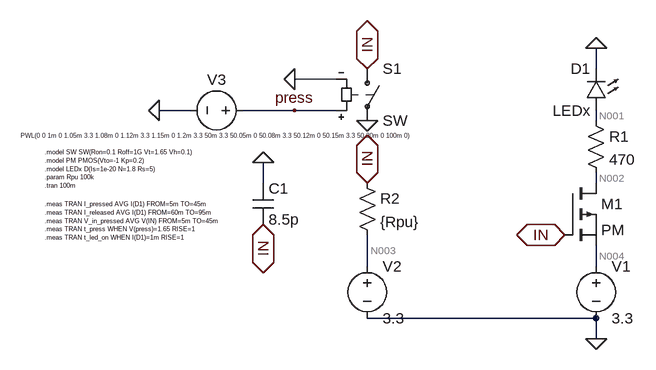
[diagram p0: schematic pMOS_Button_LED.asc]
pMOS_Button_LED.asc, the LTspice schematic file:
Version 4.1
SHEET 1 912 680
WIRE 144 -32 144 -64
WIRE -256 -16 -320 -16
WIRE -480 32 -528 32
WIRE -320 32 -400 32
WIRE -256 32 -320 32
WIRE 144 48 144 32
WIRE -368 144 -368 112
WIRE 144 144 144 128
WIRE -208 272 -208 224
WIRE 144 272 144 240
WIRE 144 352 -208 352
WIRE 144 384 144 352
FLAG 144 384 0
FLAG 144 -64 0
FLAG -368 112 0
FLAG -208 144 IN
IOPIN -208 144 BiDir
FLAG -368 208 IN
IOPIN -368 208 BiDir
FLAG -208 -32 IN
IOPIN -208 -32 BiDir
FLAG -208 48 0
FLAG 96 224 IN
IOPIN 96 224 BiDir
FLAG -528 32 0
FLAG -320 -16 0
FLAG -320 32 press
SYMBOL pmos 96 144 R0
SYMATTR InstName M1
SYMATTR Value PM
SYMBOL voltage 144 256 R0
WINDOW 123 0 0 Left 0
WINDOW 39 0 0 Left 0
SYMATTR InstName V1
SYMATTR Value 3.3
SYMBOL res 128 32 R0
SYMATTR InstName R1
SYMATTR Value 470
SYMBOL LED 160 32 R180
WINDOW 0 24 64 Left 2
WINDOW 3 24 0 Left 2
SYMATTR InstName D1
SYMATTR Value LEDx
SYMBOL sw -208 -48 R0
SYMATTR InstName S1
SYMBOL voltage -208 256 R0
WINDOW 123 0 0 Left 0
WINDOW 39 0 0 Left 0
SYMATTR InstName V2
SYMATTR Value 3.3
SYMBOL res -224 128 R0
SYMATTR InstName R2
SYMATTR Value {Rpu}
SYMBOL cap -384 144 R0
SYMATTR InstName C1
SYMATTR Value 8.5p
SYMBOL voltage -384 32 R90
WINDOW 0 -32 56 VBottom 2
WINDOW 3 32 56 VTop 0
WINDOW 123 0 0 Left 0
WINDOW 39 0 0 Left 0
SYMATTR InstName V3
SYMATTR Value PWL(0 0 1m 0 1.05m 3.3 1.08m 0 1.12m 3.3 1.15m 0 1.2m 3.3 50m 3.3 50.05m 0 50.08m 3.3 50.12m 0 50.15m 3.3 50.20m 0 100m 0)
TEXT -704 96 Left 0 !.model SW SW(Ron=0.1 Roff=1G Vt=1.65 Vh=0.1)\n.model PM PMOS(Vto=-1 Kp=0.2)\n.model LEDx D(Is=1e-20 N=1.8 Rs=5)\n.param Rpu 100k\n.tran 100m
TEXT -704 176 Left 0 !.meas TRAN I_pressed AVG I(D1) FROM=5m TO=45m\n.meas TRAN I_released AVG I(D1) FROM=60m TO=95m\n.meas TRAN V_in_pressed AVG V(IN) FROM=5m TO=45m\n.meas TRAN t_press WHEN V(press)=1.65 RISE=1\n.meas TRAN t_led_on WHEN I(D1)=1m RISE=1

The netlist it stands for:
* pMOS_Button_LED.asc
M1 N002 IN N004 N004 PM
V1 N004 0 3.3
R1 N001 N002 470
D1 N001 0 LEDx
S1 IN 0 press 0 SW
V2 N003 0 3.3
R2 IN N003 {Rpu}
C1 0 IN 8.5p
V3 press 0 PWL(0 0 1m 0 1.05m 3.3 1.08m 0 1.12m 3.3 1.15m 0 1.2m 3.3 50m 3.3 50.05m 0 50.08m 3.3 50.12m 0 50.15m 3.3 50.20m 0 100m 0)
.model D D
.lib standard.dio
.model NMOS NMOS
.model PMOS PMOS
.lib standard.mos
.model SW SW(Ron=0.1 Roff=1G Vt=1.65 Vh=0.1)
.model PM PMOS(Vto=-1 Kp=0.2)
.model LEDx D(Is=1e-20 N=1.8 Rs=5)
.param Rpu 100k
.tran 100m
.meas TRAN I_pressed AVG I(D1) FROM=5m TO=45m
.meas TRAN I_released AVG I(D1) FROM=60m TO=95m
.meas TRAN V_in_pressed AVG V(IN) FROM=5m TO=45m
.meas TRAN t_press WHEN V(press)=1.65 RISE=1
.meas TRAN t_led_on WHEN I(D1)=1m RISE=1
.backanno
.end

* Results of the author's LTspice run, read from the files saved beside the schematic
* Operating Point, zero values left out:
*   V(in) = 3.3 V
*   V(n001) = 920.4 mV
*   V(n002) = 920.4 mV
*   V(n003) = 3.3 V
*   V(n004) = 3.3 V
*   I(D1) = 4.769 pA
*   I(R1) = -4.769 pA
*   I(R2) = -3.303 nA
*   I(S1) = -3.303 nA
*   I(V1) = -4.769 pA
*   I(V2) = -3.303 nA
*   Ib(M1) = 2.39 pA
*   Id(M1) = -4.769 pA
*   Is(M1) = 2.38 pA
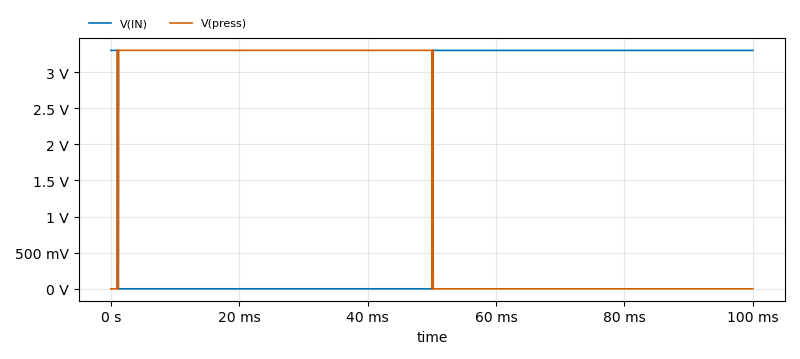
[diagram p1: Transient Analysis of pMOS_Button_LED.asc, plotted from the saved traces]
* Transient Analysis, 1 run:
*   V(IN): min 3.239 µV, max 3.3 V, average 1.683 V, rms 2.356 V, last 3.3 V
*   V(press): min 0 V, max 3.3 V, average 1.617 V, rms 2.308 V, last 0 V
* From the log:
*   i_pressed: AVG(I(D1) )=0.00298964860849 FROM 0.005 TO 0.045
*   i_released: AVG(I(D1) )=4.76927831653e-12 FROM 0.06 TO 0.095
*   v_in_pressed: AVG(V(IN) )=3.29999670612e-06 FROM 0.005 TO 0.045
*   t_press: V(press)=1.65  AT 0.00102500000004
*   t_led_on: I(D1)=1m  AT 0.00102651515186